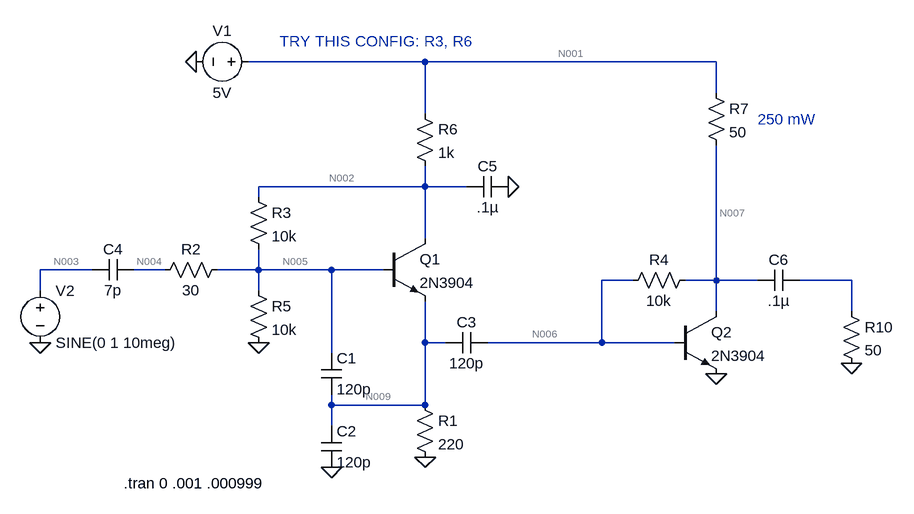
[diagram p0: schematic Draft1.asc]
Draft1.asc, the LTspice schematic file:
Version 4
SHEET 1 1524 680
WIRE 240 -144 -32 -144
WIRE 688 -144 240 -144
WIRE 688 -96 688 -144
WIRE 240 -64 240 -144
WIRE 240 48 240 16
WIRE 240 48 -16 48
WIRE 304 48 240 48
WIRE -16 64 -16 48
WIRE 240 128 240 48
WIRE -272 176 -352 176
WIRE -160 176 -208 176
WIRE -16 176 -16 144
WIRE -16 176 -80 176
WIRE 96 176 -16 176
WIRE 176 176 96 176
WIRE 560 192 512 192
WIRE 688 192 688 -16
WIRE 688 192 640 192
WIRE 752 192 688 192
WIRE 896 192 816 192
WIRE -352 208 -352 176
WIRE -16 208 -16 176
WIRE 688 240 688 192
WIRE 896 240 896 192
WIRE 240 288 240 224
WIRE 272 288 240 288
WIRE 512 288 512 192
WIRE 512 288 336 288
WIRE 624 288 512 288
WIRE 96 304 96 176
WIRE 96 384 96 368
WIRE 240 384 240 288
WIRE 240 384 96 384
WIRE 96 416 96 384
FLAG 96 480 0
FLAG 240 464 0
FLAG -112 -144 0
FLAG -352 288 0
FLAG -16 288 0
FLAG 896 320 0
FLAG 368 48 0
FLAG 688 336 0
SYMBOL npn 176 128 R0
SYMATTR InstName Q1
SYMATTR Value 2N3904
SYMBOL cap 80 304 R0
SYMATTR InstName C1
SYMATTR Value 120p
SYMBOL cap 80 416 R0
SYMATTR InstName C2
SYMATTR Value 120p
SYMBOL res 224 368 R0
SYMATTR InstName R1
SYMATTR Value 220
SYMBOL voltage -16 -144 R90
WINDOW 0 -32 56 VBottom 2
WINDOW 3 32 56 VTop 2
WINDOW 123 0 0 Left 0
WINDOW 39 0 0 Left 0
SYMATTR InstName V1
SYMATTR Value 5V
SYMBOL cap -208 160 R90
WINDOW 0 0 32 VBottom 2
WINDOW 3 32 32 VTop 2
SYMATTR InstName C4
SYMATTR Value 7p
SYMBOL voltage -352 192 R0
WINDOW 123 0 0 Left 0
WINDOW 39 0 0 Left 0
SYMATTR InstName V2
SYMATTR Value SINE(0 1 10meg)
SYMBOL cap 336 272 R90
WINDOW 0 0 32 VBottom 2
WINDOW 3 32 32 VTop 2
SYMATTR InstName C3
SYMATTR Value 120p
SYMBOL res -64 160 R90
WINDOW 0 0 56 VBottom 2
WINDOW 3 32 56 VTop 2
SYMATTR InstName R2
SYMATTR Value 30
SYMBOL res 672 -112 R0
SYMATTR InstName R7
SYMATTR Value 50
SYMBOL npn 624 240 R0
SYMATTR InstName Q2
SYMATTR Value 2N3904
SYMBOL cap 816 176 R90
WINDOW 0 0 32 VBottom 2
WINDOW 3 32 32 VTop 2
SYMATTR InstName C6
SYMATTR Value .1µ
SYMBOL res -32 48 R0
SYMATTR InstName R3
SYMATTR Value 10k
SYMBOL res -32 192 R0
SYMATTR InstName R5
SYMATTR Value 10k
SYMBOL res 656 176 R90
WINDOW 0 0 56 VBottom 2
WINDOW 3 32 56 VTop 2
SYMATTR InstName R4
SYMATTR Value 10k
SYMBOL res 880 224 R0
SYMATTR InstName R10
SYMATTR Value 50
SYMBOL res 224 -80 R0
SYMATTR InstName R6
SYMATTR Value 1k
SYMBOL cap 368 32 R90
WINDOW 0 0 32 VBottom 2
WINDOW 3 32 32 VTop 2
SYMATTR InstName C5
SYMATTR Value .1µ
TEXT -224 504 Left 2 !.tran 0 .001 .000999
TEXT 16 -176 Left 2 ;TRY THIS CONFIG: R3, R6
TEXT 752 -56 Left 2 ;250 mW

The netlist it stands for:
* Draft1.asc
Q1 N002 N005 N009 0 2N3904
C1 N005 N009 120p
C2 N009 0 120p
R1 N009 0 220
V1 N001 0 5V
C4 N004 N003 7p
V2 N003 0 SINE(0 1 10meg)
C3 N006 N009 120p
R2 N005 N004 30
R7 N001 N007 50
Q2 N007 N006 0 0 2N3904
C6 N008 N007 .1µ
R3 N002 N005 10k
R5 N005 0 10k
R4 N007 N006 10k
R10 N008 0 50
R6 N001 N002 1k
C5 0 N002 .1µ
.model NPN NPN
.model PNP PNP
.lib standard.bjt
.tran 0 .001 .000999
* TRY THIS CONFIG: R3, R6
* 250 mW
.backanno
.end

* Results of the author's LTspice run, read from the files saved beside the schematic
* Operating Point, zero values left out:
*   V(n002) = 2.487 V
*   V(n005) = 1.204 V
*   V(n009) = 526.3 mV
*   V(n001) = 5 V
*   V(n004) = 1.204 V
*   V(n006) = 766.6 mV
*   V(n007) = 2.554 V
*   Ic(Q2) = 48.74 mA
*   Ib(Q2) = 178.7 µA
*   Ie(Q2) = -48.92 mA
*   Ic(Q1) = 2.384 mA
*   Ib(Q1) = 7.894 µA
*   Ie(Q1) = -2.392 mA
*   I(R6) = 2.513 mA
*   I(R4) = 178.7 µA
*   I(R5) = 120.4 µA
*   I(R3) = 128.3 µA
*   I(R7) = 48.92 mA
*   I(R1) = 2.392 mA
*   I(V1) = -51.43 mA
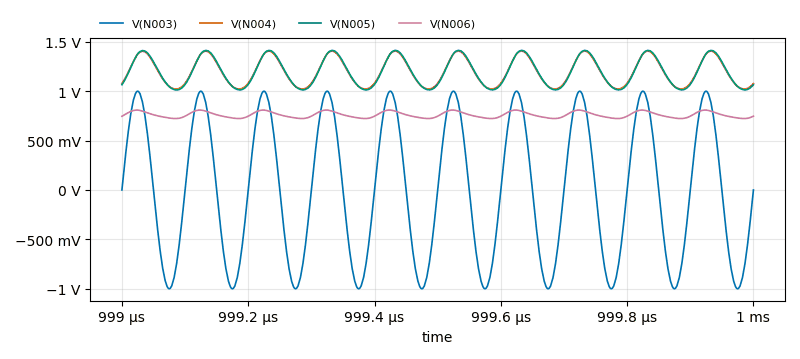
[diagram p1: Transient Analysis of Draft1.asc, plotted from the saved traces]
* Transient Analysis, 1 run:
*   V(N003): min -999.9 mV, max 999.9 mV, average 1.8 µV, rms 708.1 mV, last 0 V
*   V(N004): min 1.02 V, max 1.406 V, average 1.197 V, rms 1.205 V, last 1.076 V
*   V(N005): min 1.012 V, max 1.413 V, average 1.197 V, rms 1.206 V, last 1.065 V
*   V(N006): min 723 mV, max 808.8 mV, average 760.9 mV, rms 761.5 mV, last 745.9 mV